# Altium schematic sheet Measure.SchDoc
size A; SheetNumber: 2; SheetTotal: 2
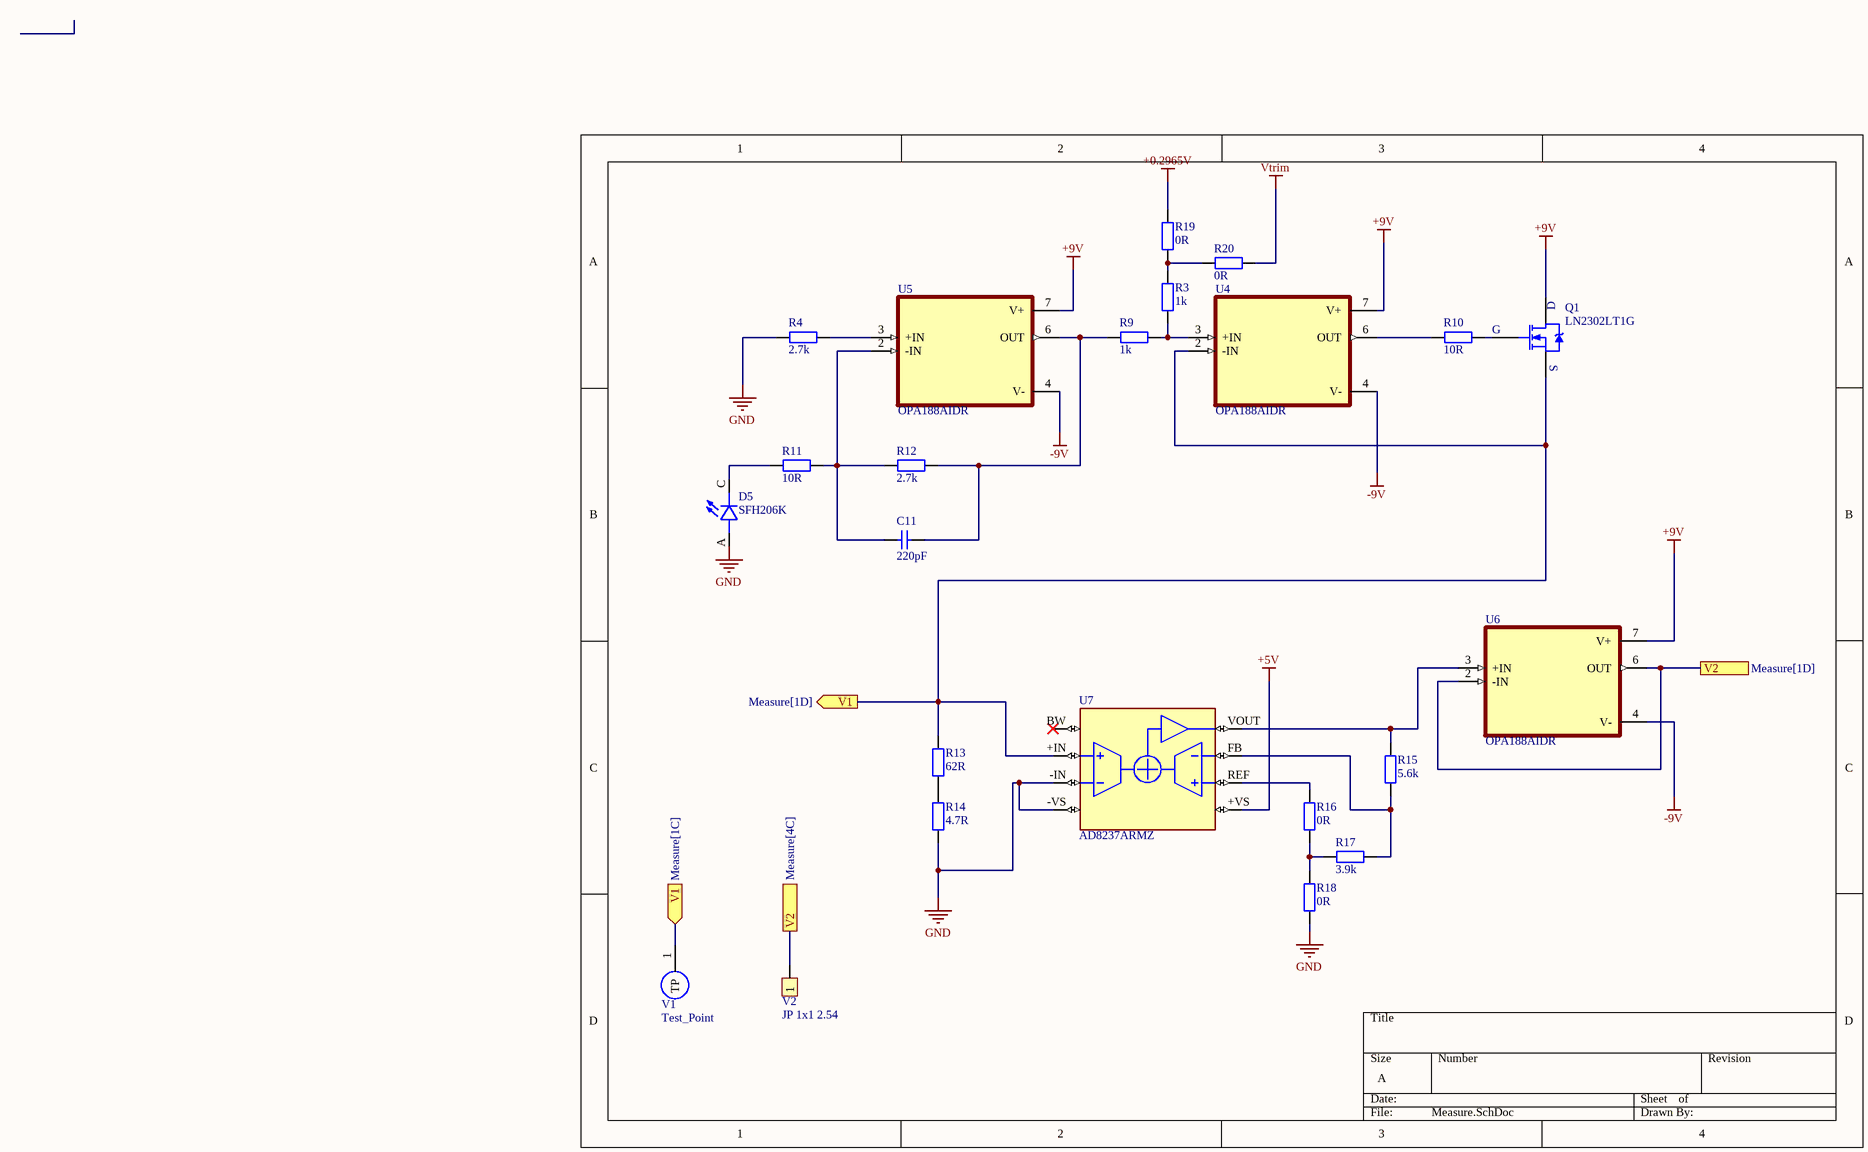
[diagram p0: Measure.SchDoc]

## Parts
C11  220pF  [Tu 0603]
D5  SFH206K  [SFH206K]
Q1  LN2302LT1G  [SOT95P240X120-3N]
R3  1k  [tro smd 0603]
R4  2.7k  [TRO SMD 0603]
R9  1k  [tro smd 0603]
R10  10R  [Tro smd 0603]
R11  10R  [Tro smd 0603]
R12  2.7k  [TRO SMD 0603]
R13  62R  [TRO SMD 0603]
R14  4.7R  [TRO SMD 0603]
R15  5.6k  [TRO SMD 0603]
R16  0R  [tro smd 0603]
R17  3.9k  [TRO SMD 0603]
R18  0R  [tro smd 0603]
R19  0R  [tro smd 0603]
R20  0R  [tro smd 0603]
U4  OPA188AIDR  [SOIC127P599X175-8N]
U5  OPA188AIDR  [SOIC127P599X175-8N]
U6  OPA188AIDR  [SOIC127P599X175-8N]
U7  AD8237ARMZ  [AD8237ARMZ]
V1  Test_Point  [TP_2MM]
V2  JP 1x1 2.54  [JP 1x1 DT]

## Ports
V1 (in, see Measure[1C]), V1 (out, see Measure[1D]), V2 (see Measure[1D]), V2 (see Measure[4C])

## Nets
+0.2965V: R19.2
+5V: U7.+VS
+9V: Q1.3(D) U4.7(V+) U5.7(V+) U6.7(V+)
-9V: U4.4(V-) U5.4(V-) U6.4(V-)
GND: D5.A R4.1 R14.1 R18.2 U7.-IN U7.-VS
Vtrim: R20.2
V1: Q1.2(S) R13.2 U4.2(-IN) U7.+IN V1.1(TP) ; port V1
V2: U6.2(-IN) U6.6(OUT) V2.1 ; port V2
NetC11_1: C11.1 R9.1 R12.2 U5.6(OUT)
NetC11_2: C11.2 R11.2 R12.1 U5.2(-IN)
NetD5_C: D5.C R11.1
NetQ1_1: Q1.1(G) R10.2
NetR3_1: R3.1 R9.2 U4.3(+IN)
NetR3_2: R3.2 R19.1 R20.1
NetR4_2: R4.2 U5.3(+IN)
NetR10_1: R10.1 U4.6(OUT)
NetR13_1: R13.1 R14.2
NetR15_1: R15.1 R17.2 U7.FB
NetR15_2: R15.2 U6.3(+IN) U7.VOUT
NetR16_1: R16.1 U7.REF
NetR16_2: R16.2 R17.1 R18.1

Not connected (* = marked no-connect by the designer): U7 BW*

## Library data of the parts
C11 = Tu 0603 220pF 50V 10%: Dán
D5 = SFH206K: photodiode, 850nm; MP: L08R5000Q1; MF: LED Technology; Value: *; SnapEDA_Link: https://www.snapeda.com/parts/L08R5000Q1/LED+Technology/view-part/?ref=snap; Check_prices: https://www.snapeda.com/parts/L08R5000Q1/LED+Technology/view-part/?ref=eda; Availability: In Stock; Price: None; Package: None
Q1 = MOSFET: SOT-23-3, MOSFET kênh N, 20V, 2.3A
R3 R9 = Tro 0603 1% 1k: Dán; So_Chan: 2; Don_Vi: Con; Ten_Linh_Kien: Trở 0603 1% 1k; Ma_Hang: MH006334; Chung_Loai: Dán; Kieu_Chan: *
R4 R12 = tro 0603 5% 2.7k: dán
R10 R11 = Tro 0603 5% 10R: Dán; So_Chan: 2; Ten_Linh_Kien: Trở 0603 5% 10R; Ma_Hang: MH006317; Don_Vi: Con; Chung_Loai: Dán; Kieu_Chan: *
R13 = Tro 0603 1% 62R: Dán
R14 = Tro 0603 1% 4.7R: Dán
R15 = Tro 0603 1% 5.6k: Dán
R16 R18-R20 = Tro 0603 1% 0R: Dán; Don_Vi: Con; So_Chan: 2; Ten_Linh_Kien: Trở 0603 1% 0R; Ma_Hang: MH005792; Chung_Loai: Dán; Kieu_Chan: *
R17 = Tro 0805 1% 3.9k: Dán
U4-U6 = OPA188AIDR: Precision, Low-Noise, Rail-to-Rail Output, 36V Zero-Drift Operational Amplifier 8-SOIC -40 to 125; MF: Texas Instruments; Package: SOIC-8 Texas Instruments; Texas_Instruments-Purchase-URL: https://snapeda.com/shop?store=Texas+Instruments&id=1236132; SnapEDA_Link: https://www.snapeda.com/parts/OPA188AIDR/Texas%20Instruments/view-part/1236132/?ref=snap; Mouser-Purchase-URL: https://snapeda.com/shop?store=Mouser&id=1236132; DigiKey-Purchase-URL: https://snapeda.com/shop?store=DigiKey&id=1236132; MP: OPA188AIDR; Digi-Key_Part_Number: 296-41346-1-ND; Value: *
U7 = AD8237ARMZ: Micropower, Zero Drift, True Rail-to-Rail Instrumentation Amplifier; MF: Analog Devices; Package: MSOP-8 Analog Devices; Price: None; Check_prices: https://www.snapeda.com/parts/AD8237ARMZ/Analog+Devices/view-part/?ref=eda; Value: *; SnapEDA_Link: https://www.snapeda.com/parts/AD8237ARMZ/Analog+Devices/view-part/?ref=snap; MP: AD8237ARMZ; Availability: In Stock; Purchase-URL: https://pricing.snapeda.com/search?q=AD8237ARMZ&ref=eda
V1 = Test_Point: Test point, 2mm radius
V2 = JP 1x1 2.54 Duc Cong: Cắm; Ten_Linh_Kien: Jump Đơn Đực 2.54MM 1x40P Cong Đứng; Don_Vi: Con; Ma_Hang: MH000904; Ghi_Chu: *; Kieu_Chan: *; Chung_Loai: Cắm